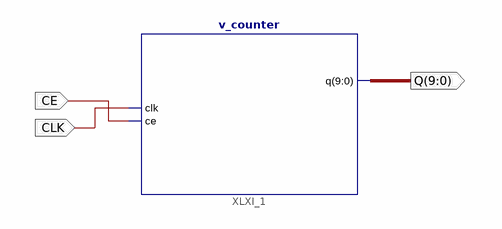
[diagram p0: schematic sheet 1]
// Xilinx ISE schematic v_counter_wrapper.sch (spartan6) as structural Verilog: 1 symbols, 3 ports
module v_counter_wrapper (
  input  CLK,
  input  CE,
  output [9:0] Q
);

  v_counter XLXI_1 (.clk(CLK), .ce(CE), .q(Q));
endmodule
